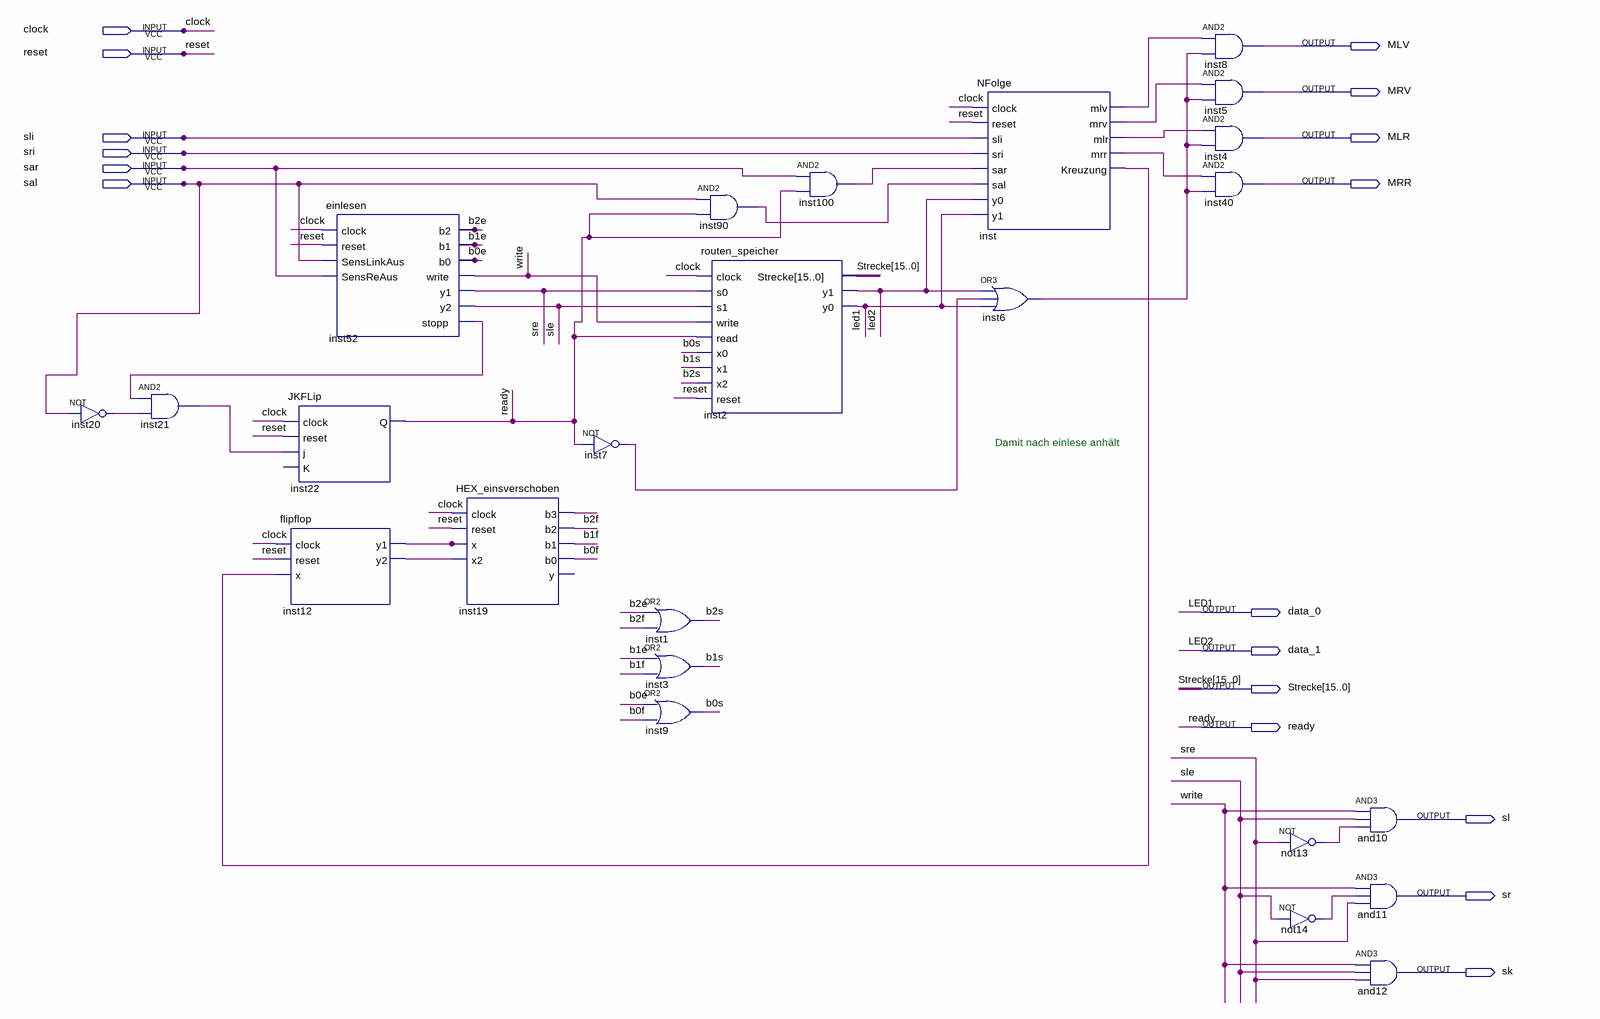
[diagram p0: schematic sheet]
// Quartus schematic NStart.bdf as structural Verilog: 24 symbols, 17 pins
module NStart (
  input  clock,
  input  reset,
  input  sli,
  input  sri,
  input  sar,
  input  sal,
  output MLV,
  output MRV,
  output MLR,
  output MRR,
  output data_0,
  output data_1,
  output [15:0] Strecke,
  output ready,
  output sl,
  output sr,
  output sk
);

  wire b0e, b0f, b0s, b1e, b1f, b1s, b2e, b2f, b2s, inst6_out, inst7_out, inst12_y1, inst12_y2, inst19_b3,
       inst20_out, inst21_out, inst52_stopp, inst90_out, inst100_out, inst_kreuzung, inst_mlr, inst_mlv,
       inst_mrr, inst_mrv, not13_out, not14_out, sle, sre, write;

  not inst20 (inst20_out, sal);
  and inst21 (inst21_out, inst52_stopp, inst20_out);
  JKFLip inst22 (.clock(clock), .reset(reset), .j(inst21_out), .Q(ready));  // open: K
  flipflop inst12 (.clock(clock), .reset(reset), .x(inst_kreuzung), .y1(inst12_y1), .y2(inst12_y2));
  einlesen inst52 (
    .clock(clock), .reset(reset), .SensLinkAus(sal), .SensReAus(sar), .b2(b2e), .b1(b1e), .b0(b0e),
    .write(write), .y1(sre), .y2(sle), .stopp(inst52_stopp));
  HEX_einsverschoben inst19 (
    .clock(clock), .reset(reset), .x(inst12_y1), .x2(inst12_y2), .b3(inst19_b3), .b2(b2f), .b1(b1f), .b0(b0f));  // open: y
  not inst7 (inst7_out, ready);
  or inst1 (b2s, b2e, b2f);
  or inst3 (b1s, b1e, b1f);
  or inst9 (b0s, b0e, b0f);
  and inst90 (inst90_out, sal, ready);
  routen_speicher inst2 (
    .clock(clock), .s0(sre), .s1(sle), .write(write), .read(ready), .x0(b0s), .x1(b1s), .x2(b2s),
    .reset(reset), .Strecke(Strecke), .y1(data_1), .y0(data_0));
  and inst100 (inst100_out, sar, ready);
  NFolge inst (
    .clock(clock), .reset(reset), .sli(sli), .sri(sri), .sar(inst100_out), .sal(inst90_out), .y0(data_1),
    .y1(data_0), .mlv(inst_mlv), .mrv(inst_mrv), .mlr(inst_mlr), .mrr(inst_mrr), .Kreuzung(inst_kreuzung));
  or inst6 (inst6_out, data_1, inst7_out, data_0);
  and inst8 (MLV, inst_mlv, inst6_out);
  and inst5 (MRV, inst_mrv, inst6_out);
  and inst4 (MLR, inst_mlr, inst6_out);
  and inst40 (MRR, inst_mrr, inst6_out);
  not not13 (not13_out, sre);
  not not14 (not14_out, sle);
  and and10 (sl, write, sle, not13_out);
  and and11 (sr, write, not14_out, sre);
  and and12 (sk, write, sle, sre);

  // Other names for the same wires on the sheet: led1 = data_0; led2 = data_1

  // Notes on the sheet:
  //   Damit nach einlese anhält
endmodule
